# EAGLE design first (EAGLE 9.6.2)
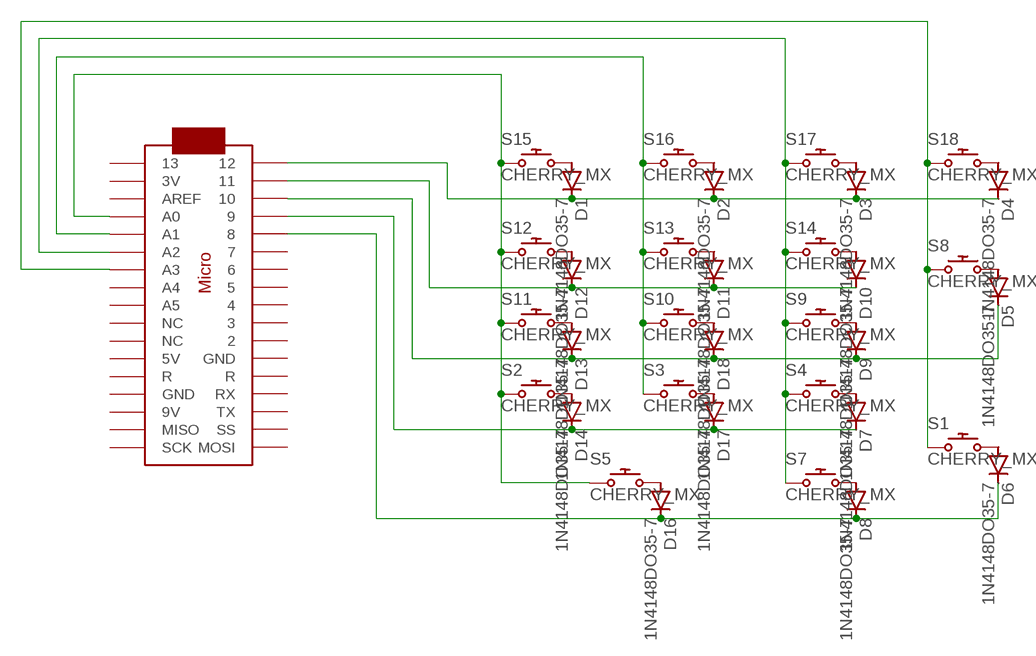
[diagram p0: schematic, sheet 1]

## Parts
D1  1N4148DO35-7  [DO35-7]
D2  1N4148DO35-7  [DO35-7]
D3  1N4148DO35-7  [DO35-7]
D4  1N4148DO35-7  [DO35-7]
D5  1N4148DO35-7  [DO35-7]
D6  1N4148DO35-7  [DO35-7]
D7  1N4148DO35-7  [DO35-7]
D8  1N4148DO35-7  [DO35-7]
D9  1N4148DO35-7  [DO35-7]
D10  1N4148DO35-7  [DO35-7]
D11  1N4148DO35-7  [DO35-7]
D12  1N4148DO35-7  [DO35-7]
D13  1N4148DO35-7  [DO35-7]
D14  1N4148DO35-7  [DO35-7]
D16  1N4148DO35-7  [DO35-7]
D17  1N4148DO35-7  [DO35-7]
D18  1N4148DO35-7  [DO35-7]
S1  CHERRY_MX  [CHERRY_MX]
S2  CHERRY_MX  [CHERRY_MX]
S3  CHERRY_MX  [CHERRY_MX]
S4  CHERRY_MX  [CHERRY_MX]
S5  CHERRY_MX  [CHERRY_MX]
S7  CHERRY_MX  [CHERRY_MX]
S8  CHERRY_MX  [CHERRY_MX]
S9  CHERRY_MX  [CHERRY_MX]
S10  CHERRY_MX  [CHERRY_MX]
S11  CHERRY_MX  [CHERRY_MX]
S12  CHERRY_MX  [CHERRY_MX]
S13  CHERRY_MX  [CHERRY_MX]
S14  CHERRY_MX  [CHERRY_MX]
S15  CHERRY_MX  [CHERRY_MX]
S16  CHERRY_MX  [CHERRY_MX]
S17  CHERRY_MX  [CHERRY_MX]
S18  CHERRY_MX  [CHERRY_MX]
U$1  ARDUINOMICRO  [ARDUINOMICRO]

## Nets
N$1: S2.S1 S5.S1 S11.S1 S12.S1 S15.S1 U$1.P$31(A0)
N$2: S3.S1 S10.S1 S13.S1 S16.S1 U$1.P$30(A1)
N$3: S4.S1 S7.S1 S9.S1 S14.S1 S17.S1 U$1.P$29(A2)
N$4: S1.S1 S8.S1 S18.S1 U$1.P$28(A3)
N$5: D1.C D2.C D3.C D4.C U$1.P$1
N$6: D10.C D11.C D12.C U$1.P$2
N$7: D5.C D9.C D13.C D18.C U$1.P$3
N$8: D7.C D14.C D17.C U$1.P$4
N$9: D6.C D8.C D16.C U$1.P$5
N$10: D1.A S15.S2
N$11: D2.A S16.S2
N$12: D3.A S17.S2
N$13: D4.A S18.S2
N$14: D5.A S8.S2
N$15: D6.A S1.S2
N$16: D7.A S4.S2
N$17: D8.A S7.S2
N$18: D9.A S9.S2
N$19: D10.A S14.S2
N$20: D11.A S13.S2
N$21: D12.A S12.S2
N$22: D13.A S11.S2
N$23: D14.A S2.S2
N$25: D16.A S5.S2
N$26: D17.A S3.S2
N$27: D18.A S10.S2
Unconnected: U$1.P$6 U$1.P$7 U$1.P$8 U$1.P$9 U$1.P$10 U$1.P$11 U$1.P$12(GND) U$1.P$13(R) U$1.P$14(RX) U$1.P$15(TX) U$1.P$16(SS) U$1.P$17(MOSI) U$1.P$18(SCK) U$1.P$19(MISO) U$1.P$20(9V) U$1.P$21(GND) U$1.P$22(R) U$1.P$23(5V) U$1.P$24(NC) U$1.P$25(NC) U$1.P$26(A5) U$1.P$27(A4) U$1.P$32(AREF) U$1.P$33(3V) U$1.P$34

## Library data of the parts
D1-D14 D16-D18 = diode:1N4148: DIODE high speed (Philips)
S1-S5 S7-S18 = cherry:CHERRY_MX: Cherry keymodule MX; FARNELL: 2292961; MOUSER: 540-MX1A-11NW
U$1 = adafruit:ARDUINOMICRO

## Board
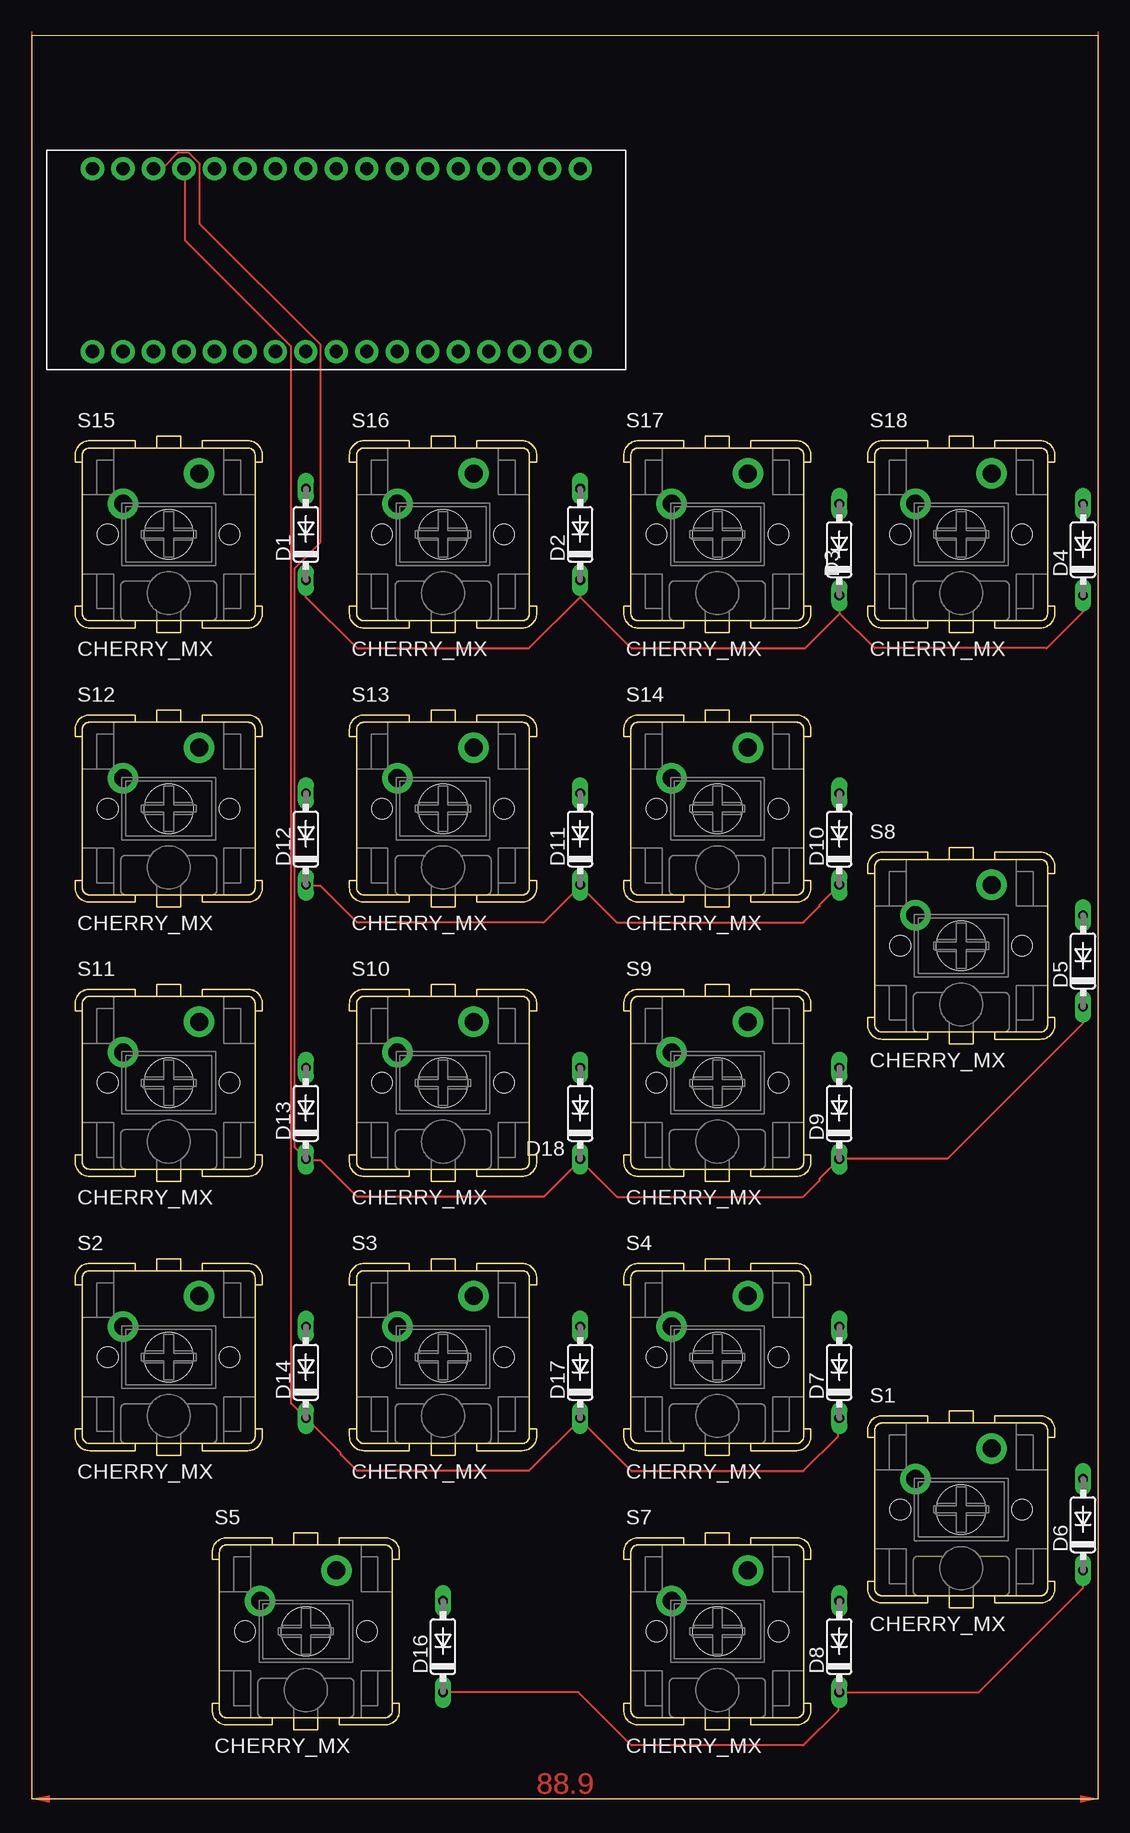
[diagram p1: board, top side]
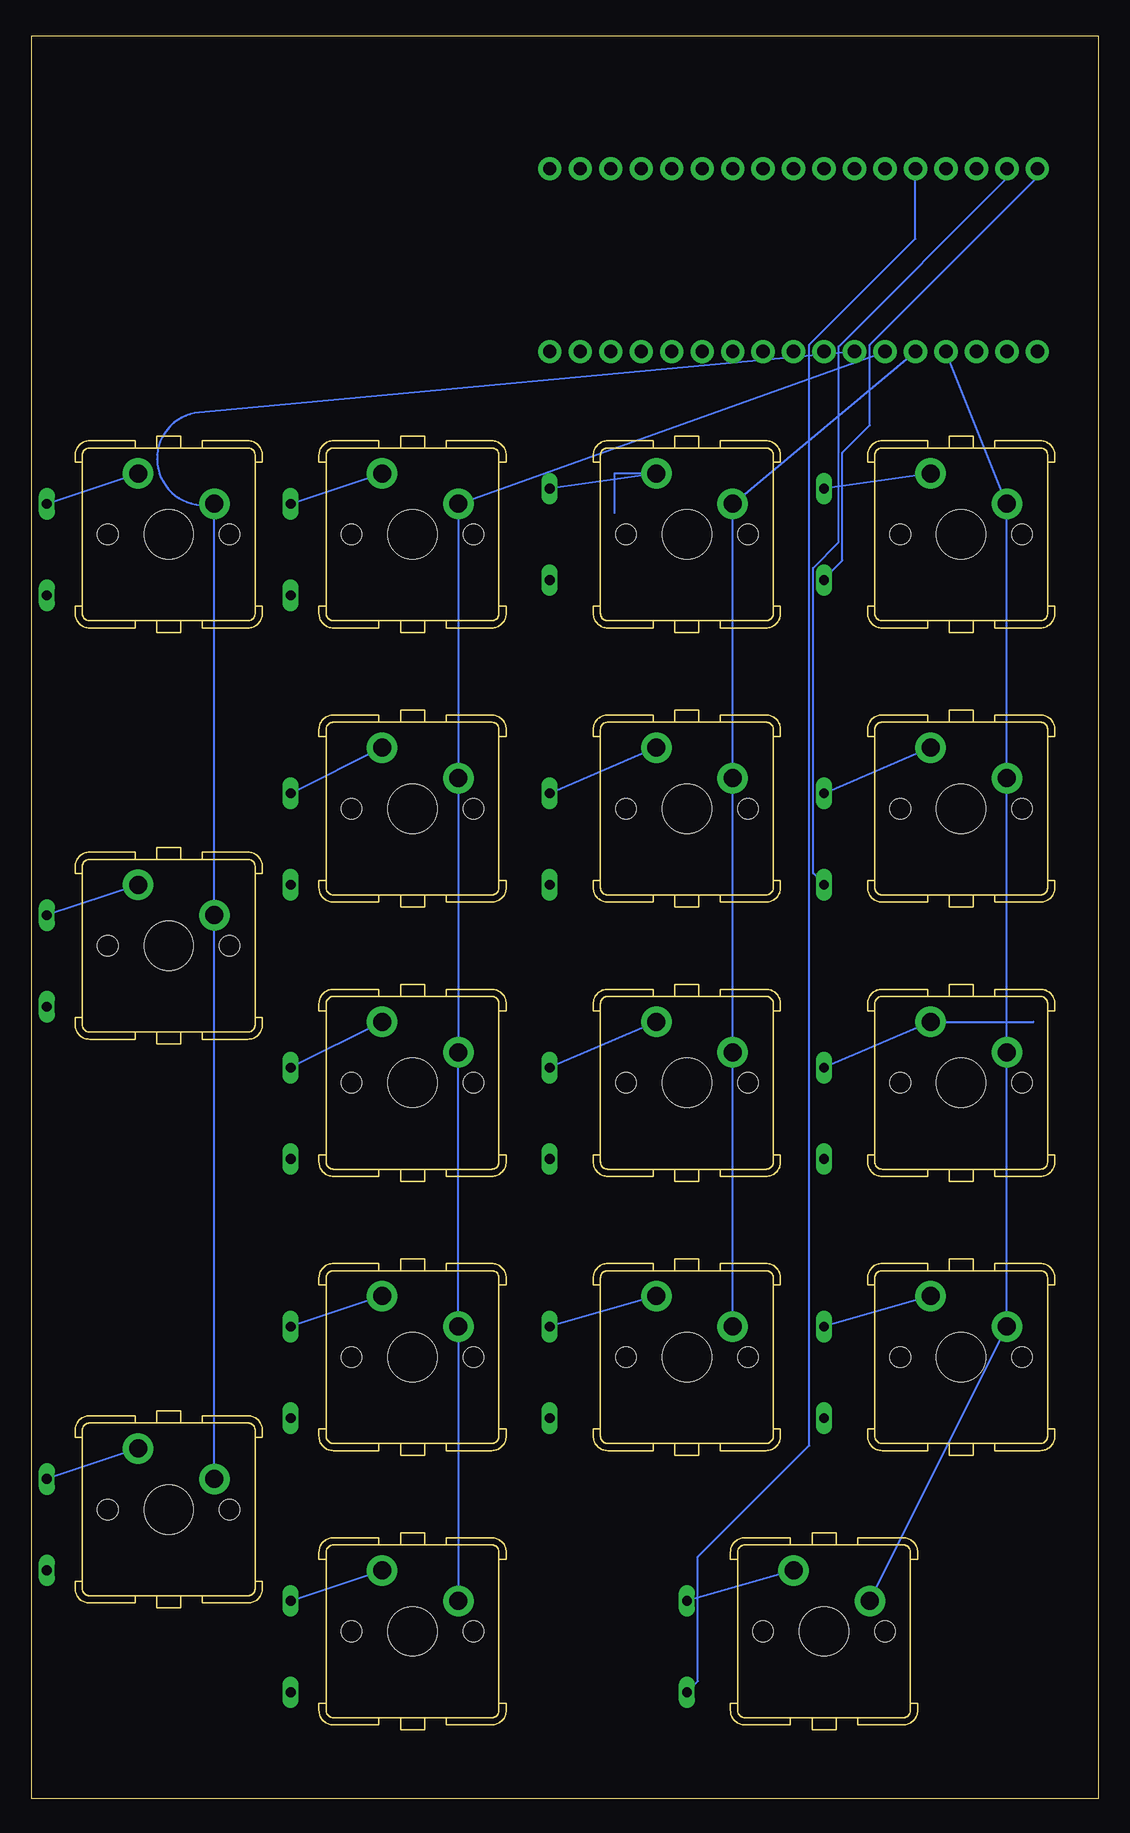
[diagram p2: board, bottom side, seen from below]

Size 88.88 x 146.99 mm. Coordinates in mm from the lower left corner, seen from the top.
Outline: 0,0 88.88,0 88.88,146.99 0,146.99 0,0
Copper layers (1*16): Top 0.035mm / dielectric 1.5mm / Bottom 0.035mm
Design rules "default": minimum track width 6mil, minimum drill 0.35mm, track to track 6mil, track to pad 6mil, pad to pad 6mil, via to via 6mil, smd to smd 6mil, copper to edge 40mil, drill to drill 6mil, minimum pad ring 10mil, minimum via ring 8mil, stop-mask expansion 4mil, vias tented up to drill 0mil, thermal gap 10mil

### Footprints (pad centres in the part's own frame; a part is rotated, then mirrored left to right if it is on the bottom)
DO35-7 = drill 0.813 long: A 3.81,0; C -3.81,0
CHERRY_MX = drill 1.5 pad 2.54: S1 -3.81,2.54; S2 2.54,5.08 | hole 1.7: -5.08,0; 5.08,0 | hole 4.1: 0,0
ARDUINOMICRO = drill 1.1 pad 1.93: P$1 -20.32,7.62; P$2 -17.78,7.62; P$3 -15.24,7.62; P$4 -12.7,7.62; P$5 -10.16,7.62; P$6 -7.62,7.62; P$7 -5.08,7.62; P$8 -2.54,7.62; P$9 0,7.62; P$10 2.54,7.62; P$11 5.08,7.62; P$12 12.7,-7.62; P$13 10.16,-7.62; P$14 12.7,7.62; P$15 15.24,7.62; P$16 17.78,7.62; P$17 20.32,7.62; P$18 20.32,-7.62; P$19 17.78,-7.62; P$20 15.24,-7.62; P$21 7.62,7.62; P$22 10.16,7.62; P$23 7.62,-7.62; P$24 5.08,-7.62; P$25 2.54,-7.62; P$26 0,-7.62; P$27 -2.54,-7.62; P$28 -5.08,-7.62; P$29 -7.62,-7.62; P$30 -10.16,-7.62; P$31 -12.7,-7.62; P$32 -15.24,-7.62; P$33 -17.78,-7.62; P$34 -20.32,-7.62

### Placement (x,y rotation side)
D1  22.86,105.41 90 top
D2  45.72,105.41 90 top
D3  67.31,104.14 90 top
D4  87.63,104.14 90 top
D5  87.63,69.85 90 top
D6  87.63,22.86 90 top
D7  67.31,35.56 90 top
D8  67.31,12.7 90 top
D9  67.31,57.15 90 top
D10  67.31,80.01 90 top
D11  45.72,80.01 90 top
D12  22.86,80.01 90 top
D13  22.86,57.15 90 top
D14  22.86,35.56 90 top
D16  34.29,12.7 90 top
D17  45.72,35.56 90 top
D18  45.72,57.15 90 top
S1  77.47,24.13 0 top
S2  11.43,36.83 0 top
S3  34.29,36.83 0 top
S4  57.15,36.83 0 top
S5  22.86,13.97 0 top
S7  57.15,13.97 0 top
S8  77.47,71.12 0 top
S9  57.15,59.69 0 top
S10  34.29,59.69 0 top
S11  11.43,59.69 0 top
S12  11.43,82.55 0 top
S13  34.29,82.55 0 top
S14  57.15,82.55 0 top
S15  11.43,105.41 0 top
S16  34.29,105.41 0 top
S17  57.15,105.41 0 top
S18  77.47,105.41 0 top
U$1  25.4,128.27 0 top

### Tracks (layer width: path | path; a pad name or v marks a point on that pad's centre or on a via)
N$1
  Bottom 0.152: S5.S1 S2.S1 S11.S1 S12.S1 S15.S1 U$1.P$31
N$2
  Bottom 0.152: S3.S1 S10.S1 S13.S1 S16.S1 U$1.P$30
N$3
  Bottom 0.152: S7.S1 S4.S1 S9.S1 S14.S1 S17.S1 U$1.P$29
N$4
  Bottom 0.152: S1.S1 S8.S1 S18.S1 arc188 74.93,115.57 U$1.P$28
N$5
  Top 0.152: 67.36,98.81 67.36,100.33 D3.C | 67.36,98.81 70.26,95.91 84.58,95.91 87.63,98.96 D4.C | D1.C 22.86,100.18 27.13,95.91 41.45,95.91 45.72,100.18 | D2.C 45.72,100.18 | 67.36,98.81 64.47,95.91 49.99,95.91 45.72,100.18
  Bottom 0.152: U$1.P$1 5.18,135.84 5.18,135.08 19.05,121.21 19.05,114.5 21.34,112.22 21.34,103.23 22.86,101.7 D1.C
N$6
  Top 0.152: 45.72,76.1 42.67,73.05 27.13,73.05 24.08,76.1 22.86,76.1 D12.C | D10.C 65.68,74.57 65.68,74.42 64.31,73.05 48.77,73.05 45.72,76.1 | 45.72,76.1 D11.C
  Bottom 0.152: U$1.P$2 7.62,135.08 21.64,121.06 21.64,104.75 23.77,102.62 23.77,77.16 22.86,76.25 D12.C
N$7
  Top 0.152: 45.72,53.24 42.67,50.19 27.13,50.19 24.08,53.24 22.86,53.24 D13.C 22.86,53.39 21.95,54.3 21.95,102.62 24.08,104.75 24.08,121.21 14.02,131.27 14.02,136.3 13.11,137.21 12.19,137.21 10.97,135.99 10.21,135.99 U$1.P$3 | 45.72,53.24 48.77,50.19 64.31,50.19 65.68,51.56 65.68,51.71 D9.C 67.36,53.39 76.35,53.39 87.63,64.67 D5.C | 45.72,53.24 D18.C
N$8
  Top 0.152: 45.72,31.6 41.45,27.33 27.13,27.33 25.76,28.7 25.76,28.85 D14.C 21.64,32.97 21.64,121.06 12.8,129.9 12.8,135.84 U$1.P$4 | 45.72,31.6 49.99,27.33 64.31,27.33 67.21,30.23 67.21,31.75 D7.C | 45.72,31.6 D17.C
N$9
  Top 0.152: D16.C 45.57,8.89 49.99,4.47 64.31,4.47 67.21,7.37 67.21,8.89 D8.C 78.94,8.89 87.63,17.58 D6.C
  Bottom 0.152: U$1.P$5 15.24,130.05 24.08,121.21 24.08,29.46 33.38,20.17 33.38,9.8 D16.C
N$10
  Bottom 0.152: S15.S2 D1.A
N$11
  Bottom 0.152: 40.33,107.19 40.33,110.49 S16.S2 D2.A
N$12
  Bottom 0.152: S17.S2 D3.A
N$13
  Bottom 0.152: S18.S2 D4.A
N$14
  Bottom 0.152: S8.S2 D5.A
N$15
  Bottom 0.152: S1.S2 D6.A
N$16
  Bottom 0.152: S4.S2 D7.A
N$17
  Bottom 0.152: D8.A S7.S2
N$18
  Bottom 0.152: S9.S2 D9.A
N$19
  Bottom 0.152: S14.S2 D10.A
N$20
  Bottom 0.152: S13.S2 D11.A
N$21
  Bottom 0.152: S12.S2 D12.A
N$22
  Bottom 0.152: 5.39,64.77 S11.S2 D13.A
N$23
  Bottom 0.152: S2.S2 D14.A
N$25
  Bottom 0.152: S5.S2 D16.A
N$26
  Bottom 0.152: S3.S2 D17.A
N$27
  Bottom 0.152: S10.S2 D18.A
(copper drawn outside any net)
  shapes: Top area x1